# EAGLE design PCB-BI8-2x4RGB (EAGLE 7.7.0)

## Sheet 1 of 2
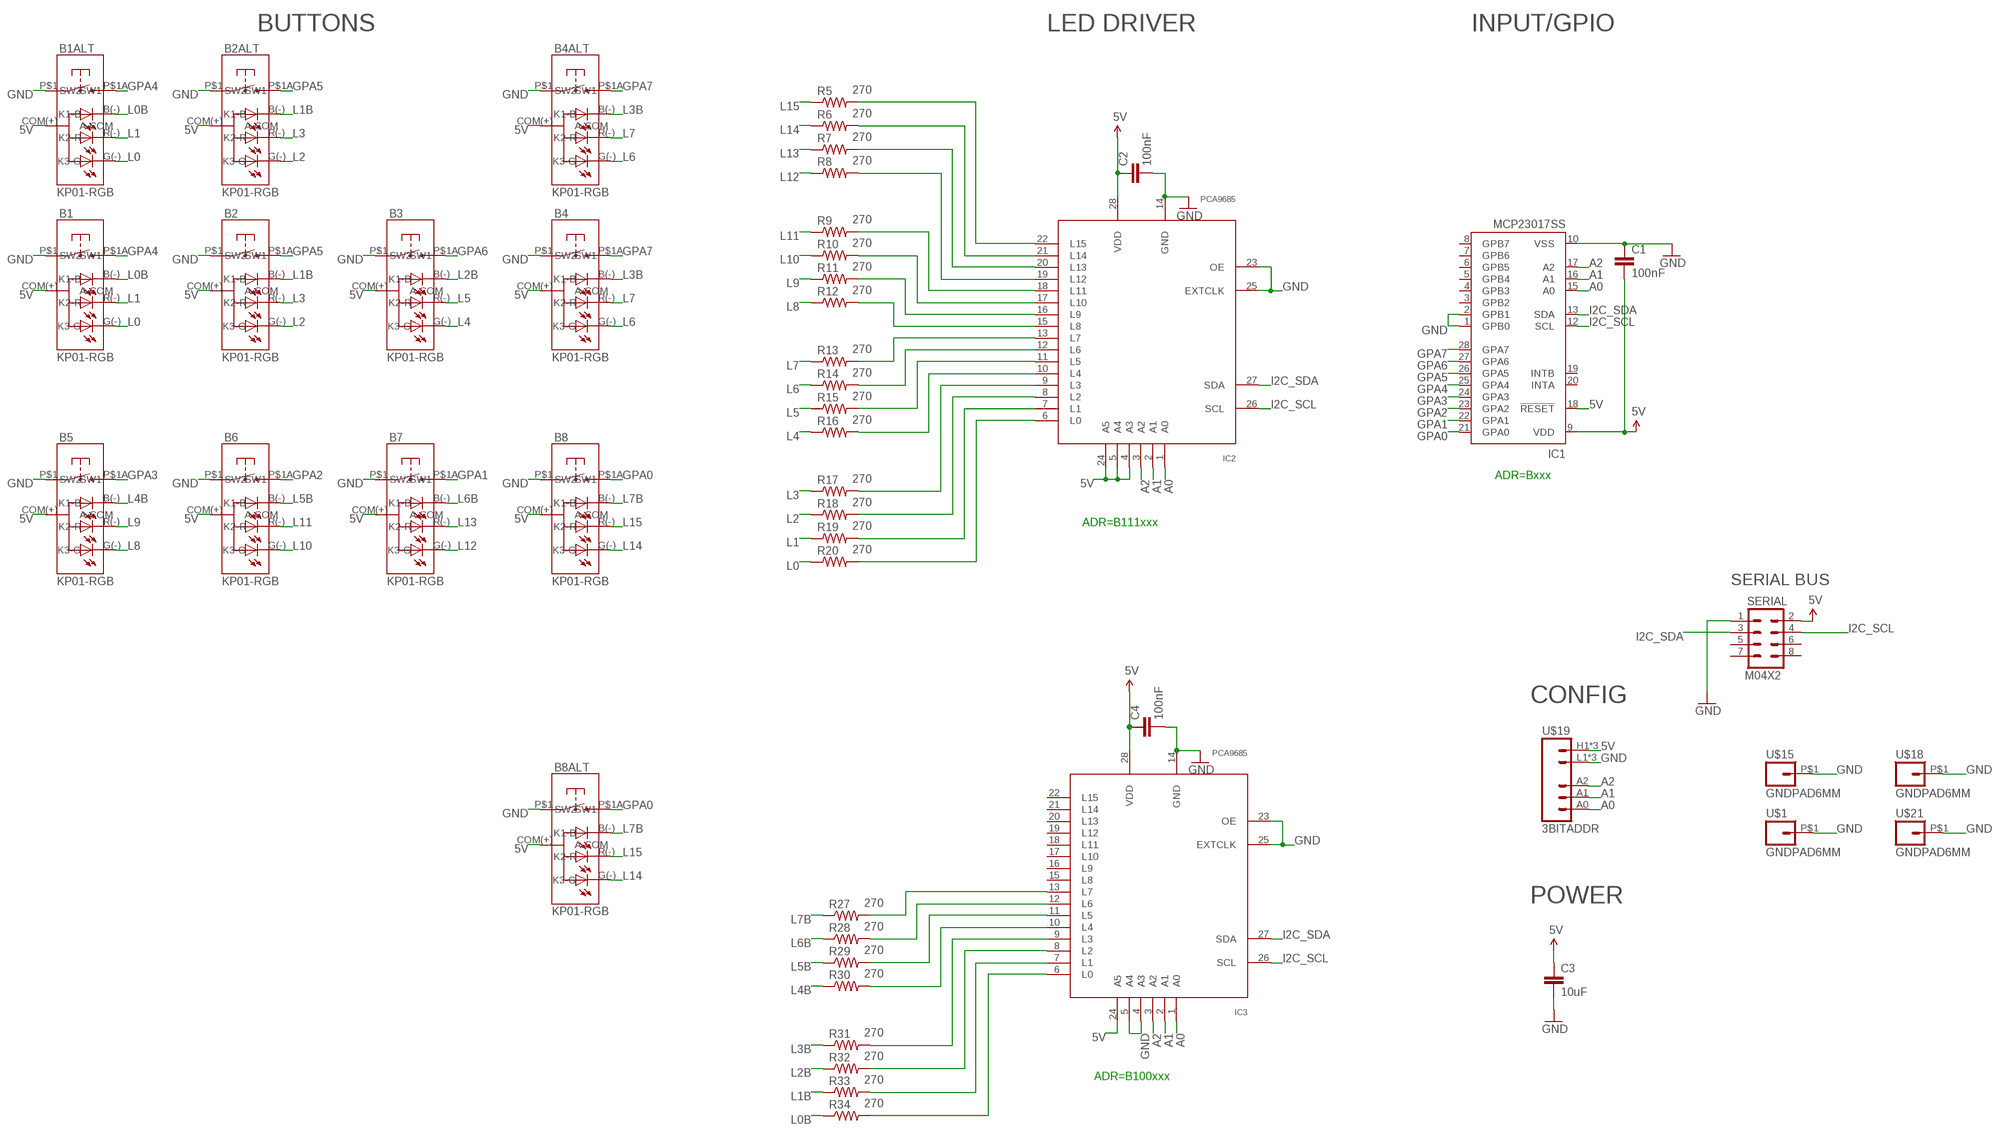
[diagram p0: schematic, sheet 1]

### Parts
B1  KP01-RGB  NKK-KP01  [NKK-KP01]
B1ALT  KP01-RGB  NKK-KP01  [NKK-KP01]
B2  KP01-RGB  NKK-KP01  [NKK-KP01]
B2ALT  KP01-RGB  NKK-KP01  [NKK-KP01]
B3  KP01-RGB  NKK-KP01  [NKK-KP01]
B4  KP01-RGB  NKK-KP01  [NKK-KP01]
B4ALT  KP01-RGB  NKK-KP01  [NKK-KP01]
B5  KP01-RGB  NKK-KP01  [NKK-KP01]
B6  KP01-RGB  NKK-KP01  [NKK-KP01]
B7  KP01-RGB  NKK-KP01  [NKK-KP01]
B8  KP01-RGB  NKK-KP01  [NKK-KP01]
B8ALT  KP01-RGB  NKK-KP01  [NKK-KP01]
C1  100nF  CAP0603-CAP  [0603-CAP]
C2  100nF  CAP0603-CAP  [0603-CAP]
C3  10uF  CAP0805  [0805]
C4  100nF  CAP0603-CAP  [0603-CAP]
IC1  MCP23017SS  [SSOP28]
IC2  PCA9685  [TSSOP28]
IC3  PCA9685  [TSSOP28]
R5  270  RESISTOR0603-RES  [0603-RES]
R6  270  RESISTOR0603-RES  [0603-RES]
R7  270  RESISTOR0603-RES  [0603-RES]
R8  270  RESISTOR0603-RES  [0603-RES]
R9  270  RESISTOR0603-RES  [0603-RES]
R10  270  RESISTOR0603-RES  [0603-RES]
R11  270  RESISTOR0603-RES  [0603-RES]
R12  270  RESISTOR0603-RES  [0603-RES]
R13  270  RESISTOR0603-RES  [0603-RES]
R14  270  RESISTOR0603-RES  [0603-RES]
R15  270  RESISTOR0603-RES  [0603-RES]
R16  270  RESISTOR0603-RES  [0603-RES]
R17  270  RESISTOR0603-RES  [0603-RES]
R18  270  RESISTOR0603-RES  [0603-RES]
R19  270  RESISTOR0603-RES  [0603-RES]
R20  270  RESISTOR0603-RES  [0603-RES]
R27  270  RESISTOR0603-RES  [0603-RES]
R28  270  RESISTOR0603-RES  [0603-RES]
R29  270  RESISTOR0603-RES  [0603-RES]
R30  270  RESISTOR0603-RES  [0603-RES]
R31  270  RESISTOR0603-RES  [0603-RES]
R32  270  RESISTOR0603-RES  [0603-RES]
R33  270  RESISTOR0603-RES  [0603-RES]
R34  270  RESISTOR0603-RES  [0603-RES]
SERIAL  M04X2  [2X4]
U$1  GNDPAD6MM  [3.2MMPAD6MM]
U$15  GNDPAD6MM  [3.2MMPAD6MM]
U$18  GNDPAD6MM  [3.2MMPAD6MM]
U$19  3BITADDR  [3BITADDR]
U$21  GNDPAD6MM  [3.2MMPAD6MM]

### Nets
5V [Power]: B1.COM(+)(A-COM) B1ALT.COM(+)(A-COM) B2.COM(+)(A-COM) B2ALT.COM(+)(A-COM) B3.COM(+)(A-COM) B4.COM(+)(A-COM) B4ALT.COM(+)(A-COM) B5.COM(+)(A-COM) B6.COM(+)(A-COM) B7.COM(+)(A-COM) B8.COM(+)(A-COM) B8ALT.COM(+)(A-COM) C1.2 C2.1 C3.1 C4.1 IC1.9(VDD) IC1.18(!RESET) IC2.4(A3) IC2.5(A4) IC2.24(A5) IC2.28(VDD) IC3.24(A5) IC3.28(VDD) SERIAL.2 U$19.H1(VCC) U$19.H2(VCC) U$19.H3(VCC)
A0: IC1.15(A0) IC2.1(A0) IC3.1(A0) U$19.A0
A1: IC1.16(A1) IC2.2(A1) IC3.2(A1) U$19.A1
A2: IC1.17(A2) IC2.3(A2) IC3.3(A2) U$19.A2
GND [Power]: B1.P$1(SW1) B1ALT.P$1(SW1) B2.P$1(SW1) B2ALT.P$1(SW1) B3.P$1(SW1) B4.P$1(SW1) B4ALT.P$1(SW1) B5.P$1(SW1) B6.P$1(SW1) B7.P$1(SW1) B8.P$1(SW1) B8ALT.P$1(SW1) C1.1 C2.2 C3.2 C4.2 IC1.1(GPB0) IC1.2(GPB1) IC1.10(VSS) IC2.14(GND) IC2.23(OE) IC2.25(EXTCLK) IC3.4(A3) IC3.5(A4) IC3.14(GND) IC3.23(OE) IC3.25(EXTCLK) SERIAL.1 U$1.P$1 U$15.P$1 U$18.P$1 U$19.L1(GND) U$19.L2(GND) U$19.L3(GND) U$21.P$1
GPA0: B8.P$1A(SW2) B8ALT.P$1A(SW2) IC1.21(GPA0)
GPA1: B7.P$1A(SW2) IC1.22(GPA1)
GPA2: B6.P$1A(SW2) IC1.23(GPA2)
GPA3: B5.P$1A(SW2) IC1.24(GPA3)
GPA4: B1.P$1A(SW2) B1ALT.P$1A(SW2) IC1.25(GPA4)
GPA5: B2.P$1A(SW2) B2ALT.P$1A(SW2) IC1.26(GPA5)
GPA6: B3.P$1A(SW2) IC1.27(GPA6)
GPA7: B4.P$1A(SW2) B4ALT.P$1A(SW2) IC1.28(GPA7)
I2C_SCL: IC1.12(SCL) IC2.26(SCL) IC3.26(SCL) SERIAL.4
I2C_SDA: IC1.13(SDA) IC2.27(SDA) IC3.27(SDA) SERIAL.3
L0: B1.G(-)(K3-G) B1ALT.G(-)(K3-G) R20.1
L0B: B1.B(-)(K1-B) B1ALT.B(-)(K1-B) R34.1
L1: B1.R(-)(K2-R) B1ALT.R(-)(K2-R) R19.1
L1B: B2.B(-)(K1-B) B2ALT.B(-)(K1-B) R33.1
L2: B2.G(-)(K3-G) B2ALT.G(-)(K3-G) R18.1
L2B: B3.B(-)(K1-B) R32.1
L3: B2.R(-)(K2-R) B2ALT.R(-)(K2-R) R17.1
L3B: B4.B(-)(K1-B) B4ALT.B(-)(K1-B) R31.1
L4: B3.G(-)(K3-G) R16.1
L4B: B5.B(-)(K1-B) R30.1
L5: B3.R(-)(K2-R) R15.1
L5B: B6.B(-)(K1-B) R29.1
L6: B4.G(-)(K3-G) B4ALT.G(-)(K3-G) R14.1
L6B: B7.B(-)(K1-B) R28.1
L7: B4.R(-)(K2-R) B4ALT.R(-)(K2-R) R13.1
L7B: B8.B(-)(K1-B) B8ALT.B(-)(K1-B) R27.1
L8: B5.G(-)(K3-G) R12.1
L9: B5.R(-)(K2-R) R11.1
L10: B6.G(-)(K3-G) R10.1
L11: B6.R(-)(K2-R) R9.1
L12: B7.G(-)(K3-G) R8.1
L13: B7.R(-)(K2-R) R7.1
L14: B8.G(-)(K3-G) B8ALT.G(-)(K3-G) R6.1
L15: B8.R(-)(K2-R) B8ALT.R(-)(K2-R) R5.1
N$2: IC3.13(L7) R27.2
N$3: IC3.12(L6) R28.2
N$4: IC2.13(L7) R13.2
N$5: IC2.12(L6) R14.2
N$6: IC3.11(L5) R29.2
N$7: IC2.11(L5) R15.2
N$9: IC2.10(L4) R16.2
N$10: IC2.9(L3) R17.2
N$11: IC2.8(L2) R18.2
N$12: IC2.7(L1) R19.2
N$13: IC3.10(L4) R30.2
N$14: IC3.9(L3) R31.2
N$15: IC3.8(L2) R32.2
N$16: IC3.7(L1) R33.2
N$17: IC3.6(L0) R34.2
N$19: IC2.6(L0) R20.2
N$20: IC2.15(L8) R12.2
N$21: IC2.16(L9) R11.2
N$22: IC2.17(L10) R10.2
N$23: IC2.18(L11) R9.2
N$24: IC2.19(L12) R8.2
N$25: IC2.20(L13) R7.2
N$26: IC2.21(L14) R6.2
N$27: IC2.22(L15) R5.2
Unconnected: IC1.3(GPB2) IC1.4(GPB3) IC1.5(GPB4) IC1.6(GPB5) IC1.7(GPB6) IC1.8(GPB7) IC1.19(INTB) IC1.20(INTA) IC3.15(L8) IC3.16(L9) IC3.17(L10) IC3.18(L11) IC3.19(L12) IC3.20(L13) IC3.21(L14) IC3.22(L15) SERIAL.5 SERIAL.6 SERIAL.7 SERIAL.8

### Notes on the sheet
- BUTTONS | LED DRIVER | INPUT/GPIO
- ADR=Bxxx
- ADR=B111xxx
- SERIAL BUS
- CONFIG
- POWER
- ADR=B100xxx

## Sheet 2 of 2

## Library data of the parts
B1 B1ALT B2 B2ALT B3 B4 B4ALT B5-B8 B8ALT = SKAARHOJ:NKK-KP01: NKK-KP01-15AC 100mA12VDC
C1-C4 = SparkFun:CAP: Capacitor Standard 0603 ceramic capacitor, and 0.1" leaded capacitor.
IC1 = microchip:MCP23017: http://ww1.microchip.com/downloads/en/DeviceDoc/21952a.pdf Source: http://ww1.microchip.com/downloads/en/DeviceDoc/21952a.pdf; MF: MICROCHIP; MPN: MCP23017-E/SS; OC_FARNELL: 1467674; OC_NEWARK: 31K2960
IC2 IC3 = wsmith:PCA9685
R5-R20 R27-R34 = SparkFun:RESISTOR: Resistor Basic schematic elements and footprints for 0603, 1206, and PTH resistors.
SERIAL = SparkFun:M04X2
U$1 U$15 U$18 U$21 = SKAARHOJ:GNDPAD
U$19 = SKAARHOJ:3BITADDR

## Net classes
0 default: width 0.152 mm, drill 0.254 mm, clearance 0.152 mm
1 Power: width 0.406 mm, drill 0.61 mm, clearance 0.203 mm

## Board
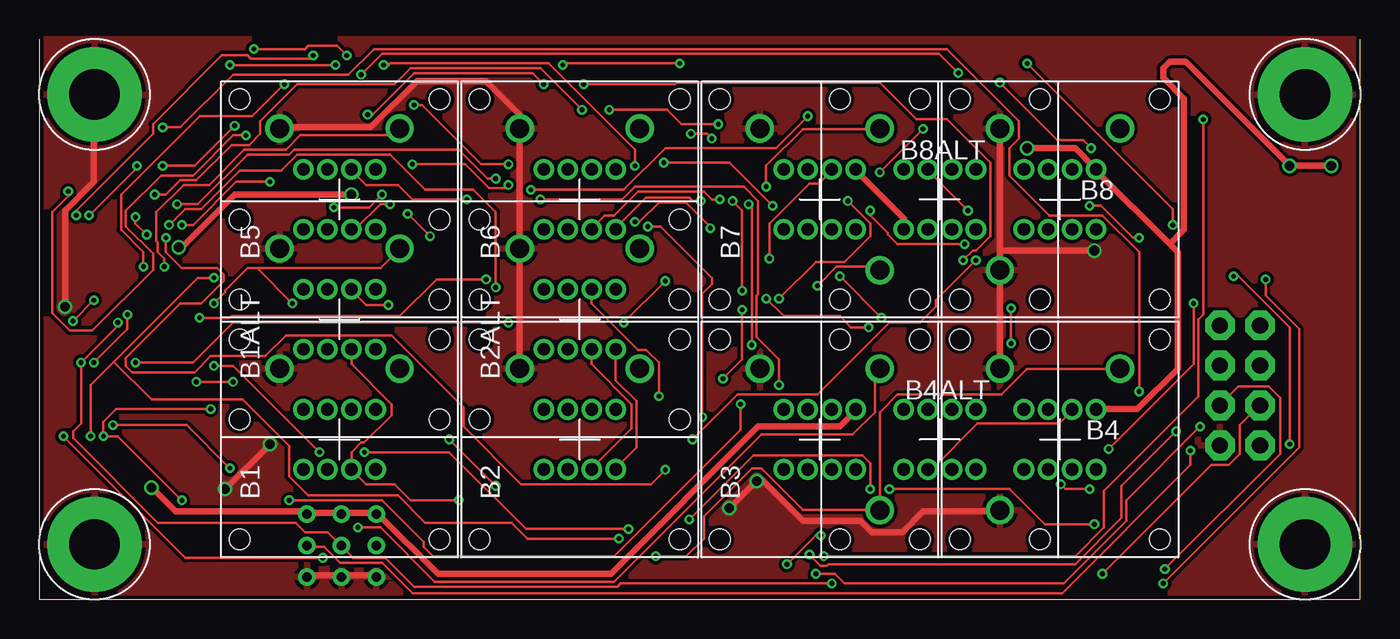
[diagram p1: board, top side]
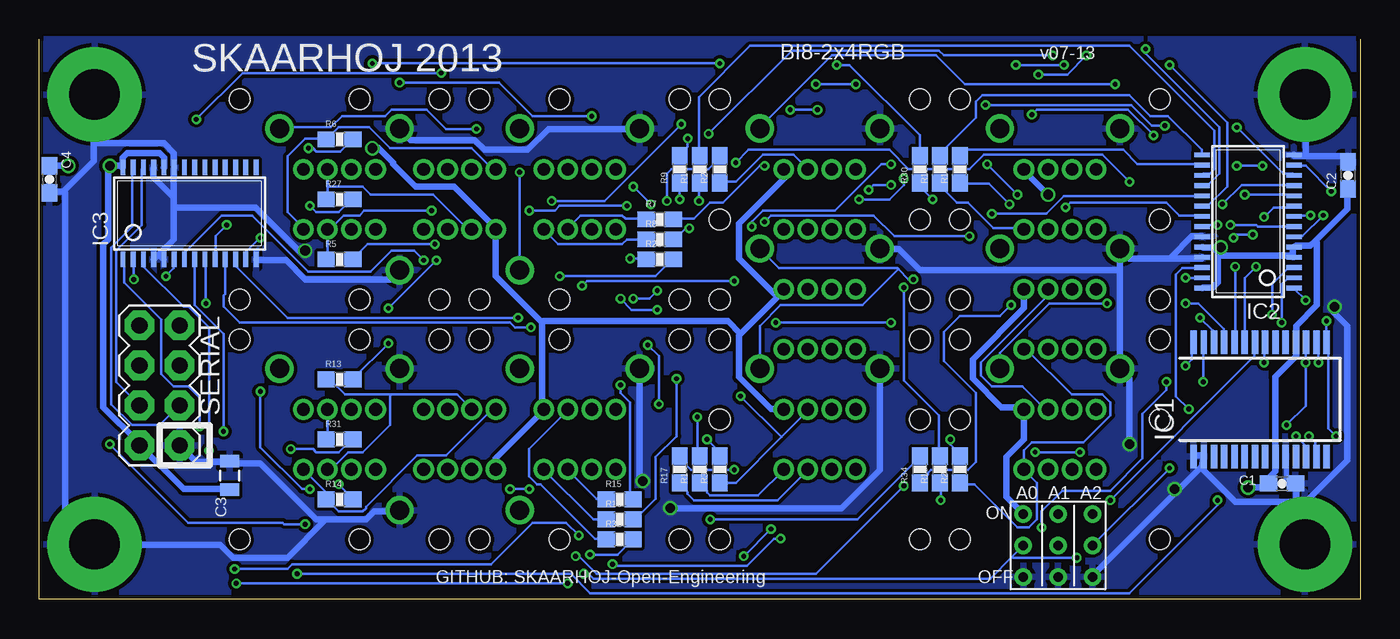
[diagram p2: board, bottom side, seen from below]

Size 83.82 x 35.56 mm. Coordinates in mm from the lower left corner, seen from the top.
Outline: 83.82,35.56 83.82,0 0,0 0,35.56
Copper layers (1*16): Top 0.035mm / dielectric 1.5mm / Bottom 0.035mm
Design rules "Fusion_eagle_rule_v1.1": minimum track width 6mil, minimum drill 12mil, track to track 6mil, track to pad 6mil, pad to pad 6mil, via to via 6mil, smd to smd 0mil, copper to edge 10mil, drill to drill 10mil, minimum pad ring 10mil, minimum via ring 6mil, stop-mask expansion 2mil, vias tented up to drill 100mil, thermal gap 10mil

### Footprints (pad centres in the part's own frame; a part is rotated, then mirrored left to right if it is on the bottom)
NKK-KP01 = drill 0.8: B(-) 1.905,-0.762; COM(+) 1.905,-2.286; G(-) -1.905,-2.286; P$3 1.905,0.762; P$4 1.905,2.286; P$7 -1.905,0.762; P$8 -1.905,2.286; R(-) -1.905,-0.762 | drill 1.2: P$1 4.496,3.81; P$1A 4.496,-3.81 | hole 1.3: -6.35,6.35; 6.35,6.35; 6.35,-6.35; -6.35,-6.35
0603-CAP = smd 1.1 x 1: 1 -0.85,0; 2 0.85,0
0805 = smd 0.8 x 1.2: 1 -0.9,0; 2 0.9,0
SSOP28 = smd 0.4 x 1.5: 1 -4.225,-3.625; 2 -3.575,-3.625; 3 -2.925,-3.625; 4 -2.275,-3.625; 5 -1.625,-3.625; 6 -0.975,-3.625; 7 -0.325,-3.625; 8 0.325,-3.625; 9 0.975,-3.625; 10 1.625,-3.625; 11 2.275,-3.625; 12 2.925,-3.625; 13 3.575,-3.625; 14 4.225,-3.625; 15 4.225,3.625; 16 3.575,3.625; 17 2.925,3.625; 18 2.275,3.625; 19 1.625,3.625; 20 0.975,3.625; 21 0.325,3.625; 22 -0.325,3.625; 23 -0.975,3.625; 24 -1.625,3.625; 25 -2.275,3.625; 26 -2.925,3.625; 27 -3.575,3.625; 28 -4.225,3.625
TSSOP28 = smd 0.305 x 0.991: 1 -4.225,-2.918; 2 -3.575,-2.918; 3 -2.925,-2.918; 4 -2.275,-2.918; 5 -1.625,-2.918; 6 -0.975,-2.918; 7 -0.325,-2.918; 8 0.325,-2.918; 9 0.975,-2.918; 10 1.625,-2.918; 11 2.275,-2.918; 12 2.925,-2.918; 13 3.575,-2.918; 14 4.225,-2.918; 15 4.225,2.918; 16 3.575,2.918; 17 2.925,2.918; 18 2.275,2.918; 19 1.625,2.918; 20 0.975,2.918; 21 0.325,2.918; 22 -0.325,2.918; 23 -0.975,2.918; 24 -1.625,2.918; 25 -2.275,2.918; 26 -2.925,2.918; 27 -3.575,2.918; 28 -4.225,2.918
0603-RES = smd 1.1 x 1: 1 -0.85,0; 2 0.85,0
2X4 = drill 1.016 pad 1.88 octagon: 1 -3.81,-1.27; 2 -3.81,1.27; 3 -1.27,-1.27; 4 -1.27,1.27; 5 1.27,-1.27; 6 1.27,1.27; 7 3.81,-1.27; 8 3.81,1.27
3.2MMPAD6MM = drill 3.2 pad 6: P$1 0,0
3BITADDR = drill 0.6: A0 -2.2,0; A1 0,0; A2 2.2,0; H1 -2.2,2; H2 0,2; H3 2.2,2; L1 -2.2,-2; L2 0,-2; L3 2.2,-2

### Placement (x,y rotation side)
B1  19.05,10.16 90 top
B1ALT  19.05,17.78 90 top
B2  34.29,10.16 90 top
B2ALT  34.29,17.78 90 top
B3  49.53,10.16 90 top
B4  64.77,10.16 90 top
B4ALT  57.15,10.16 270 top
B5  19.05,25.4 90 top
B6  34.29,25.4 90 top
B7  49.53,25.4 90 top
B8  64.77,25.4 90 top
B8ALT  57.15,25.4 270 top
C1  4.95,7.37 180 bottom
C2  0.76,26.92 90 bottom
C3  71.75,7.87 90 bottom
C4  83.19,26.67 270 bottom
IC1  6.35,12.7 0 bottom
IC2  7.11,24 90 bottom
IC3  74.3,24.51 0 bottom
R5  64.77,21.59 0 bottom
R6  64.77,29.21 0 bottom
R7  44.45,24.13 0 bottom
R8  44.45,22.86 0 bottom
R9  43.18,27.3 90 bottom
R10  41.91,27.3 90 bottom
R11  25.4,27.3 90 bottom
R12  26.67,27.3 90 bottom
R13  64.77,13.97 0 bottom
R14  64.77,6.35 0 bottom
R15  46.99,6.35 0 bottom
R16  46.99,5.08 0 bottom
R17  43.18,8.26 90 bottom
R18  41.91,8.26 90 bottom
R19  26.67,8.26 90 bottom
R20  25.4,8.26 90 bottom
R27  64.77,25.4 0 bottom
R28  44.45,21.59 0 bottom
R29  40.64,27.3 90 bottom
R30  27.94,27.3 90 bottom
R31  64.77,10.16 0 bottom
R32  46.99,3.81 0 bottom
R33  40.64,8.26 90 bottom
R34  27.94,8.26 90 bottom
SERIAL  76.2,13.59 90 bottom
U$1  3.5,3.5 0 top
U$15  3.5,32.06 0 top
U$18  80.32,3.5 0 top
U$19  19.18,3.43 0 bottom
U$21  80.32,32.06 0 top

### Tracks (layer width: path | path; a pad name or v marks a point on that pad's centre or on a via)
5V  (via drill 0.61)
  Top 0.406: v19.81,25.7 12.39,25.7 9.04,22.35 v8.84,22.35 | v7.11,7.11 8.64,5.59 16.87,5.59 U$19.H3 17.07,5.49 19.1,5.49 U$19.H2 19.3,5.49 21.34,5.49 U$19.H1 21.54,5.38 25.3,1.63 36.27,1.63 45.62,10.97 50.8,10.97 51.82,11.99 B3.COM(+) | B8ALT.COM(+) 54.86,24.18 51.82,27.23 B7.COM(+) | 71.73,22.55 67.06,27.23 B8.COM(+) 66.95,27.43 65.73,28.65 v62.69,28.65 | 71.73,22.55 72.24,22.05 72.24,14.63 69.7,12.09 67.06,12.09 B4.COM(+) | v81.99,27.53 v79.35,27.53 72.75,34.14 71.73,34.14 71.32,33.73 71.32,33.12 72.64,31.8 72.64,23.47 71.73,22.55
  Bottom 0.406: U$19.H1 21.44,5.49 22.45,6.5 22.45,9.04 21.34,10.16 B1.COM(+) 21.44,12.19 22.76,12.19 24.59,14.02 24.59,15.24 21.34,18.49 B1ALT.COM(+) | 9.04,22.05 9.04,21.84 | 9.04,21.84 9.04,20.12 9.35,19.81 9.96,19.81 IC2.28 | 9.04,22.05 9.35,22.35 9.96,22.35 IC2.24 | 2.85,22.76 3.15,22.45 4.06,22.45 IC2.5 4.27,22.35 4.27,21.74 IC2.4 4.37,21.84 9.04,21.84 | 2.85,22.76 0.81,24.79 0.81,26.01 C2.1 | 2.85,22.76 2.74,22.66 2.74,18.69 4.06,17.37 4.06,16.36 IC1.18 4.06,16.15 4.06,15.44 5.38,14.12 5.38,9.25 IC1.9 5.38,9.04 5.38,8.13 5.79,7.72 5.79,7.42 C1.2 5.99,7.32 6.2,7.11 v7.11,7.11 | v19.81,25.7 21.34,27.23 B5.COM(+) | v8.84,22.35 9.04,22.15 9.04,22.05 | 39.32,16.87 36.58,19.61 B2ALT.COM(+) 37.08,19.3 39.42,21.64 39.42,23.88 36.58,26.72 B6.COM(+) | 39.32,16.87 39.42,16.76 39.42,14.12 37.39,12.09 36.58,12.09 B2.COM(+) | B4ALT.COM(+) 54.86,8.94 51.82,11.99 B3.COM(+) 51.92,12.19 51.92,17.58 | 51.92,17.58 54.86,20.52 B8ALT.COM(+) 54.97,23.67 57.51,26.21 59.94,26.21 61.37,27.64 61.37,27.74 62.28,28.65 v62.69,28.65 | 39.32,16.87 40.13,17.68 51.82,17.68 51.92,17.58 | IC3.24 75.89,27.43 75.89,28.04 76.2,28.35 78.23,28.35 78.54,28.04 78.54,27.43 IC3.28 78.64,27.53 v79.35,27.53 79.45,27.43 79.45,22.86 79.76,22.55 79.76,12.19 77.52,9.96 SERIAL.2 77.42,9.75 74.68,7.01 71.83,7.01 C3.1 | v81.99,27.53 83.11,27.53 C4.1
A0  (via drill 0.3)
  Top 0.152: v2.13,17.68 v3.45,19 | v73.66,10.97 68.99,6.3 68.99,4.98 65.02,1.02 51.1,1.02 50.49,1.63 v49.28,1.63 | v1.52,10.36 9.25,2.64 v17.98,2.64
  Bottom 0.152: v3.45,19 4.17,19.71 IC2.1 | v2.13,17.68 2.13,16.36 IC1.15 2.03,16.26 2.03,10.87 v1.52,10.36 | v73.66,10.97 73.66,12.8 74.37,13.51 75.29,13.51 76.1,14.33 76.1,17.78 78.44,20.12 78.44,21.54 IC3.1 | v49.28,1.63 48.97,1.63 48.67,1.32 23.47,1.32 22.1,2.69 | 22.1,2.69 21.44,3.35 U$19.A0 | v17.98,2.64 22.05,2.64 22.1,2.69
A1  (via drill 0.3)
  Top 0.152: v4.98,17.58 4.98,17.37 v2.64,15.04 2.64,11.18 2.13,10.67 2.13,10.26 7.52,4.88 16.26,4.88 16.87,4.27 18.29,4.27 19.1,3.45 U$19.A1 19.2,3.35 19.91,2.64 21.95,2.64 23.77,0.81 36.68,0.81 36.88,1.02 v50.29,1.02 | v77.83,20.32 77.83,19.3 79.96,17.17 79.96,9.65 v71.32,1.02
  Bottom 0.152: v4.98,17.58 4.98,20.02 4.57,20.42 4.27,20.42 IC2.2 | v2.64,15.04 2.64,16.15 2.74,16.26 IC1.16 | v77.83,20.32 77.83,21.54 IC3.2 | v50.29,1.02 v71.32,1.02
A2  (via drill 0.3)
  Top 0.152: v5.59,18.09 5.59,17.17 v3.45,15.04 | v73.05,9.45 73.05,8.53 64.92,0.41 23.67,0.41 21.74,2.34 19.1,2.34 18.09,3.35 17.07,3.35 U$19.A2 | v4.67,11.07 9.35,11.07 v12.09,8.33
  Bottom 0.152: v5.59,18.09 5.59,20.02 4.57,21.03 4.27,21.03 IC2.3 | IC1.17 3.45,16.26 v3.45,15.04 3.45,12.29 v4.67,11.07 | v73.05,9.45 73.05,17.27 74.37,18.59 74.68,18.59 77.22,21.13 77.22,21.54 IC3.3 | v12.09,8.33 16.97,3.45 U$19.A2
GND  (via drill 0.61)
  Top 0.406: U$19.L3 17.07,1.52 19.1,1.52 U$19.L2 19.3,1.52 21.34,1.52 U$19.L1 | v1.63,18.59 1.63,24.69 3.45,26.52 3.45,32 U$15.P$1 | B4.P$1 B8ALT.P$1 60.96,22.15 | B8.P$1 60.96,22.15 | B2.P$1 B2ALT.P$1 B6.P$1 30.48,30.79 28.35,32.92 23.98,32.92 21.03,29.97 15.24,29.97 B5.P$1 | B4ALT.P$1 60.96,5.59 56.08,5.59 54.76,4.27 52.83,4.27 52.12,4.98 48.46,4.98 45.92,7.52 v45.52,7.52 v43.79,5.79 | v66.95,22.15 60.96,22.15 | v14.63,9.86 v11.79,7.01
  Bottom 0.305: IC1.10 4.7,9.07 4.7,7.75 4.1,7.75 C1.1
  Bottom 0.406: 3.45,28.14 1.12,28.14 0.81,27.84 C2.2 | 3.45,28.14 4.17,28.14 IC2.14 | 3.45,28.14 3.45,32 U$15.P$1 | IC1.2 9.96,9.14 10.57,9.14 IC1.1 | U$1.P$1 4.06,4.06 4.06,7.32 C1.1 | IC1.2 9.96,8.94 9.96,8.23 7.92,6.2 4.17,6.2 U$1.P$1 | 11.68,6.81 10.06,8.43 IC1.2 | 11.68,6.81 16.97,1.52 U$19.L3 | v1.63,18.59 1.63,18.19 0.81,17.37 0.81,8.84 3.86,5.79 U$1.P$1 | IC3.14 70,21.54 68.17,21.54 66.95,20.32 61.47,20.32 60.96,20.83 B8ALT.P$1 | B7.P$1 45.72,29.87 51.51,29.87 52.83,28.55 55.58,28.55 56.19,29.16 60.25,29.16 60.96,29.87 B8.P$1 | 11.99,21.64 14.63,21.64 15.24,22.25 B1ALT.P$1 15.24,20.93 | 11.99,21.64 10.06,21.64 IC2.25 | IC2.23 10.06,23.06 10.67,23.06 11.99,21.74 11.99,21.64 | 15.24,20.93 B1.P$1 15.14,14.53 14.63,14.02 v14.63,9.86 | 15.24,20.93 27.94,20.93 29.26,22.25 30.48,22.25 B2ALT.P$1 | 75.29,24.89 75.29,22.86 76.25,21.89 | 75.29,24.89 75.29,25.6 | 75.29,25.6 75.29,27.33 IC3.23 75.29,27.64 75.29,28.35 75.89,28.96 80.37,28.96 | 76.25,21.89 76.5,21.64 IC3.4 | 76.25,21.89 76,21.64 IC3.5 | IC3.25 76.61,27.33 76.61,26.82 75.39,25.6 75.29,25.6 | 82.3,25.91 83.11,25.91 C4.2 | 82.3,25.91 80.37,27.84 80.37,28.96 | 80.37,28.96 80.37,32 U$21.P$1 | SERIAL.1 74.88,9.75 73.86,8.74 71.83,8.74 C3.2 71.63,8.64 69.8,8.64 66.24,5.08 65.73,5.08 | 65.73,5.08 63.09,5.08 62.59,5.59 60.96,5.59 B4ALT.P$1 | B3.P$1 45.72,7.72 v45.52,7.52 | 65.73,5.08 65.73,4.98 68.07,2.64 71.53,2.64 72.34,3.45 80.26,3.45 U$18.P$1 80.37,3.66 82.19,5.49 82.19,25.81 82.3,25.91 | B2.P$1 30.48,8.23 32.92,5.79 v43.79,5.79 | v66.95,22.15 67.36,22.15 70.1,24.89 75.29,24.89 | v11.79,7.01 11.79,6.91 11.68,6.81
  pour Top: 0,0 83.82,0 83.82,35.56 0,35.56
  pour Bottom: 0,0 83.82,0 83.82,35.56 0,35.56
GPA0  (via drill 0.3)
  Top 0.152: v6.1,15.04 9.75,15.04 12.29,17.58 v29.77,17.58 | v39.73,20.22 v37.08,17.58 | v49.38,19.91 50.6,21.13 53.14,21.13 53.34,20.93 B8ALT.P$1A | v53.34,27.13 v56.08,29.87
  Bottom 0.152: v6.1,15.04 6.1,16.26 IC1.21 | v37.08,17.58 v29.77,17.58 | v39.73,20.22 49.07,20.22 v49.38,19.91 | v56.08,29.87 58.01,29.87 59.23,31.09 61.47,31.09 61.87,30.68 64.62,30.68 65.33,29.97 68.58,29.97 B8.P$1A | B8ALT.P$1A v53.34,27.13
GPA1  (via drill 0.3)
  Top 0.152: v15.85,6.3 21.74,6.3 24.38,3.66 24.38,3.35 24.99,2.74 36.47,2.74 44.5,10.77 v44.5,12.39 | v45.21,16.15 45.21,24.89 v45.01,25.09 | v46.13,26.21 46.13,27.53 48.46,29.87 53.34,29.87 B7.P$1A
  Bottom 0.152: v15.85,6.3 6.71,15.44 6.71,16.26 IC1.22 | v44.5,12.39 44.5,15.44 v45.21,16.15 | v46.13,26.21 v45.01,25.09
GPA2  (via drill 0.3)
  Top 0.152: v6.6,21.13 6.6,22.05 5.18,23.47 5.18,25.7 10.16,30.68 13.51,30.68 v15.54,32.72
  Bottom 0.152: v6.6,21.13 7.32,20.42 7.32,16.36 IC1.23 | v15.54,32.72 25.09,32.72 26.92,34.54 33.53,34.54 38.1,29.97 B6.P$1A
GPA3  (via drill 0.3)
  Top 0.152: v7.92,21.13 7.92,21.64 7.52,22.05 7.52,22.66 7.42,22.76 7.42,24.59 9.14,26.31 10.77,26.31 13.01,28.55 15.65,28.55 16.56,29.46 22.45,29.46 22.86,29.87 B5.P$1A
  Bottom 0.152: v7.92,21.13 7.92,16.36 IC1.24
GPA4  (via drill 0.3)
  Top 0.152: v11.07,18.8 11.79,19.51 11.79,19.61 13.21,21.03 13.82,21.03 | 13.82,21.03 21.64,21.03 22.86,22.25 B1ALT.P$1A | 13.82,21.03 v16.05,18.8
  Bottom 0.152: v11.07,18.8 10.26,18.8 8.64,17.17 8.64,16.36 IC1.25 | B1.P$1A 22.86,15.65 19.71,18.8 v16.05,18.8
GPA5  (via drill 0.3)
  Top 0.152: v10.16,17.88 12.09,17.88 12.19,17.98 22.86,17.98 25.2,20.32 v28.35,20.32
  Bottom 0.152: v10.16,17.88 9.35,17.07 9.35,16.36 IC1.26 | v28.35,20.32 28.65,20.32 29.31,20.98 | 29.31,20.98 29.36,21.03 36.88,21.03 38.1,22.25 B2ALT.P$1A | B2.P$1A 38.1,17.37 36.78,18.69 31.6,18.69 29.31,20.98
GPA6  (via drill 0.3)
  Top 0.152: v12.29,13.82 v9.96,13.82 | v20.22,4.57 21.64,4.57 25.09,1.12 36.47,1.12 45.82,10.46 51.61,10.46 53.03,11.89 53.03,14.33 53.34,14.63 B3.P$1A
  Bottom 0.152: v9.96,13.82 9.96,16.26 IC1.27 | v12.29,13.82 12.29,13.31 13.82,11.79 13.82,8.94 15.85,6.91 18.9,6.91 20.22,5.59 v20.22,4.57
GPA7  (via drill 0.3)
  Top 0.152: v11.07,14.83 12.29,14.83 v17.78,9.35 | v20.62,9.35 26.01,9.35 30.89,4.47 v37.39,4.47 | v39.12,2.74 41.05,2.74 42.16,3.86 42.16,5.28 45.21,8.33 45.82,8.33 48.46,5.69 53.34,5.69 | 53.34,5.69 53.34,11.89 54.46,13.01 61.06,13.01 62.69,14.63 68.58,14.63 B4.P$1A | 53.34,5.69 B4ALT.P$1A
  Bottom 0.152: v11.07,14.83 10.67,15.24 10.67,16.26 IC1.28 | v20.62,9.35 v17.78,9.35 | v39.12,2.74 v37.39,4.47
I2C_SCL  (via drill 0.3)
  Top 0.152: v10.87,12.09 4.88,12.09 4.06,11.28 v4.06,10.36 4.98,10.36 v9.04,6.3 | v67.46,1.63 74.37,8.53 75.49,8.53 76.2,9.25 76.2,11.07 77.42,12.29 SERIAL.4
  Bottom 0.152: v10.87,12.09 11.68,12.9 11.68,20.62 11.28,21.03 10.06,21.03 IC2.26 | v4.06,10.36 3.45,9.75 3.45,9.14 IC1.12 | IC3.26 77.32,27.33 77.32,23.77 78.94,22.15 78.94,13.82 77.52,12.39 SERIAL.4 | v9.04,6.3 9.04,5.99 14.63,0.41 48.87,0.41 50.09,1.63 v67.46,1.63
I2C_SDA  (via drill 0.3)
  Top 0.152: v11.07,20.42 10.06,20.42 4.72,15.09 | 4.72,15.09 3.25,13.61 v3.25,10.36 | 4.72,15.09 7.11,12.7 12.9,12.7 15.85,9.75 15.85,7.82 17.07,6.6 22.76,6.6 24.49,4.88 29.97,4.88 30.99,3.86 v36.78,3.86 | v47.45,2.23 49.28,4.06 v49.58,4.06 | v71.42,1.93 78.74,9.25 78.74,12.8 78.03,13.51 76.1,13.51 74.98,12.39 SERIAL.3
  Bottom 0.152: v11.07,20.42 10.06,20.42 IC2.27 | v3.25,10.36 2.85,9.96 2.85,9.14 IC1.13 | IC3.27 77.93,27.33 77.93,23.67 79.25,22.35 79.25,12.39 77.93,11.07 76.2,11.07 74.98,12.29 SERIAL.3 | v36.78,3.86 37.19,3.86 38.91,2.13 47.35,2.13 v47.45,2.23 | v49.58,4.06 50.39,4.88 52.53,4.88 55.17,2.23 67.77,2.23 68.07,1.93 v71.42,1.93
L0
  Bottom 0.152: R20.1 25.4,7.32 24.49,7.32 21.74,4.57 21.03,4.57 20.52,5.08 20.52,7.42 21.34,8.23 B1.G(-) 21.34,9.45 20.83,9.96 17.58,9.96 15.85,11.68 15.85,12.5 16.36,13.01 18.29,13.01 21.13,15.85 21.34,15.85 B1ALT.G(-)
L0B  (via drill 0.3)
  Top 0.152: v22.15,18.69 20.73,18.69 19.81,19.61 B1ALT.B(-)
  Bottom 0.152: v22.15,18.69 22.86,17.98 25.4,17.98 26.42,16.97 26.42,15.14 24.38,13.11 24.38,8.74 24.89,8.23 27.23,8.23 27.43,8.03 27.43,7.92 R34.1 | B1ALT.B(-) 19.81,19.3 24.08,15.04 24.08,14.22 23.37,13.51 21.44,13.51 20.02,12.09 19.81,12.09 B1.B(-)
L1  (via drill 0.3)
  Top 0.152: v26.62,6.3 23.57,6.3 22.55,7.32 20.73,7.32 19.81,8.23 B1.R(-) 19.81,9.35 20.42,9.96 20.62,9.96 22.35,11.68 22.35,12.39 19.81,14.94 B1ALT.R(-)
  Bottom 0.152: v26.62,6.3 26.62,7.32 R19.1
L1B  (via drill 0.3)
  Top 0.152: B2ALT.B(-) 35.05,18.8 38,15.85 38.51,15.85 39.32,15.04 v39.32,12.9
  Bottom 0.152: 36.73,10.31 35.05,11.99 B2.B(-) | 36.73,10.31 39.62,7.42 R33.1 | 36.73,10.31 v39.32,12.9
L2
  Top 0.152: B2ALT.G(-) 36.58,13.92 37.9,12.6 37.9,9.65 36.58,8.33 B2.G(-)
  Bottom 0.152: R18.1 41.86,7.32 41.45,6.91 41.45,6.81 41.25,6.6 38.2,6.6 36.58,8.23 B2.G(-)
L2B
  Bottom 0.152: R32.1 47.85,3.86 48.56,3.86 52.02,7.32 52.22,7.32 52.73,7.82 52.73,9.55 50.29,11.99 B3.B(-)
L3
  Top 0.152: B2ALT.R(-) 35.05,14.94 37.59,12.39 37.59,10.87 35.05,8.33 B2.R(-)
  Bottom 0.152: R17.1 43.18,7.32 42.67,6.81 42.67,6.71 42.27,6.3 36.98,6.3 35.05,8.23 B2.R(-)
L3B
  Top 0.152: B4ALT.B(-) 56.39,8.33 56.69,8.33 59.54,11.18 64.72,11.18 65.53,11.99 B4.B(-)
  Bottom 0.152: B4.B(-) 65.53,10.16 R31.1
L4
  Bottom 0.152: R16.1 48.67,5.08 51.82,8.23 B3.G(-)
L4B  (via drill 0.3)
  Top 0.152: v27.13,25.4 23.67,25.4 22.76,26.31 20.73,26.31 19.81,27.23 B5.B(-)
  Bottom 0.152: R30.1 27.94,26.21 v27.13,25.4
L5
  Bottom 0.152: R15.1 47.85,6.4 48.46,6.4 50.29,8.23 B3.R(-)
L5B
  Bottom 0.152: R29.1 40.64,26.52 39.62,26.52 37.9,28.25 35.97,28.25 35.05,27.33 B6.B(-)
L6
  Bottom 0.152: B4.G(-) 67.06,8.23 65.63,6.81 65.63,6.4 R14.1 65.53,6.3 64.82,5.59 63.3,5.59 63.09,5.79 63.09,5.89 59.84,9.14 58.01,9.14 55.17,11.99 54.86,11.99 B4ALT.G(-)
L6B  (via drill 0.3)
  Top 0.152: v46.33,21.64 46.33,23.88 48.87,26.42 49.48,26.42 50.29,27.23 B7.B(-)
  Bottom 0.152: v46.33,21.64 45.31,21.64 R28.1
L7
  Bottom 0.152: 61.57,13.01 57.3,13.01 56.39,12.09 B4ALT.R(-) | 61.57,13.01 64.41,13.01 65.33,13.92 65.53,13.92 R13.1 | 61.57,13.01 61.57,11.07 63.3,9.35 64.21,9.35 65.23,8.33 65.53,8.33 B4.R(-)
L7B
  Bottom 0.152: B8.B(-) 65.53,26.21 | 65.53,26.21 65.53,25.4 R27.1 | 65.53,26.21 63.3,26.21 62.79,25.7 58.83,25.7 56.69,23.57 56.39,23.57 B8ALT.B(-)
L8
  Bottom 0.152: R12.1 26.62,26.42 26.62,26.21 25.6,25.2 24.89,25.2 23.27,23.57 21.34,23.57 B5.G(-)
L9  (via drill 0.3)
  Top 0.152: v22.25,25.09 21.64,25.09 20.12,23.57 19.81,23.57 B5.R(-)
  Bottom 0.152: v22.25,25.09 23.57,26.42 25.4,26.42 R11.1
L10  (via drill 0.3)
  Top 0.152: v41.96,25.3 41.45,25.3 41.25,25.5 38.51,25.5 36.58,23.57 B6.G(-)
  Bottom 0.152: v41.96,25.3 41.96,26.42 R10.1
L11  (via drill 0.3)
  Top 0.152: v43.18,25.4 42.67,25.4 42.16,25.91 38,25.91 36.47,24.38 35.87,24.38 35.05,23.57 B6.R(-)
  Bottom 0.152: v43.18,25.4 R9.1
L12
  Bottom 0.152: R8.1 46.53,22.86 46.84,22.55 50.9,22.55 51.82,23.47 B7.G(-)
L13
  Bottom 0.152: R7.1 45.31,24.18 46.63,24.18 46.84,24.38 49.48,24.38 50.29,23.57 B7.R(-)
L14
  Bottom 0.152: B8.G(-) 67.06,23.57 68.07,24.59 68.07,28.14 66.95,29.26 65.63,29.26 R6.1 65.53,29.26 64.82,29.97 62.89,29.97 61.57,28.65 56.39,28.65 55.07,27.33 54.86,27.33 B8ALT.G(-)
L15  (via drill 0.3)
  Top 0.152: v58.93,24.69 56.39,27.23 B8ALT.R(-)
  Bottom 0.152: 65.53,23.37 B8.R(-) 65.53,23.47 | 65.53,23.37 65.53,21.64 R5.1 | v58.93,24.69 63.2,24.69 63.5,24.38 64.52,24.38 65.53,23.37
N$2  (via drill 0.3)
  Top 0.152: v69.8,22.96 69.39,22.96 67.36,24.99 v66.65,24.99
  Bottom 0.152: v69.8,22.96 70.71,22.05 70.71,21.64 IC3.13 | v66.65,24.99 66.24,24.59 64.82,24.59 64.01,25.4 R27.2
N$3  (via drill 0.3)
  Top 0.152: v50.8,20.52 v53.44,17.88
  Bottom 0.152: v53.44,17.88 68.07,17.88 71.32,21.13 71.32,21.54 IC3.12 | v50.8,20.52 44.7,20.52 43.69,21.54 R28.2
N$4  (via drill 0.3)
  Top 0.152: v1.83,25.91 1.83,25.6 0.81,24.59 0.81,18.19 1.93,17.07 3.35,17.07 7.21,20.93 7.21,21.95 5.49,23.67 5.49,24.69 7.72,26.92 9.75,26.92 12.29,29.46 v13.11,29.46 | v20.83,30.79 21.13,30.79 23.77,33.43 31.29,33.43 v32,32.72 | v34.54,32.72 40.34,32.72 40.44,32.82 53.34,32.82 55.68,30.48 57.61,30.48 60.35,27.74 60.35,23.06 59.44,22.15 59.23,22.15 v58.62,21.54 | v61.67,16.26 v61.67,18.49
  Bottom 0.152: v1.83,25.91 3.45,27.53 4.17,27.53 IC2.13 | v13.11,29.46 14.73,31.09 20.52,31.09 v20.83,30.79 | v34.54,32.72 v32,32.72 | v61.67,18.49 v58.62,21.54 | v61.67,16.26 63.91,14.02 R13.2
N$5  (via drill 0.3)
  Top 0.152: v7.82,29.97 8.94,29.97 12.29,33.33 19.61,33.33 21.23,34.95 57.61,34.95 62.18,30.38 62.18,29.26 61.57,28.65 61.57,26.92 64.11,24.38 67.46,24.38 69.8,22.05 v69.8,13.21 | v66.65,7.01 65.13,7.01 v64.82,7.32
  Bottom 0.152: v7.82,29.97 4.88,27.03 4.27,27.03 IC2.12 | v69.8,13.21 69.8,9.65 67.16,7.01 v66.65,7.01 | v64.82,7.32 63.91,6.4 R14.2
N$6  (via drill 0.3)
  Top 0.152: v52.63,17.27 51.51,17.27 50.8,17.98 47.24,17.98 v46.13,19.1 | v44.6,19.61 44.6,24.69 v43.99,25.3
  Bottom 0.152: v52.63,17.27 53.65,17.27 53.95,17.58 71.12,17.58 72.14,18.59 72.14,19.3 72.03,19.41 72.03,21.54 IC3.11 | v46.13,19.1 45.11,19.1 v44.6,19.61 | v43.99,25.3 43.99,27.03 43.69,27.33 41.35,27.33 40.64,28.04 R29.2
N$7  (via drill 0.3)
  Top 0.152: v8.74,25.09 10.06,25.09 13.21,28.25 15.85,28.25 16.15,28.55 26.62,28.55 28.45,26.72 v28.96,26.72 | v31.8,25.4 36.98,25.4 37.8,26.21 44.7,26.21 45.62,25.3 45.62,19.41 45.52,19.3 45.52,16.66 46.94,15.24 v46.94,13.61
  Bottom 0.152: v8.74,25.09 7.52,26.31 4.27,26.31 IC2.11 | v28.96,26.72 28.96,26.31 29.87,25.4 v31.8,25.4 | v46.94,13.61 46.94,13.11 46.33,12.5 46.33,6.5 46.23,6.4 R15.2
N$9  (via drill 0.3)
  Top 0.152: v7.32,25.7 8.03,25.7 8.94,26.62 9.96,26.62 12.19,28.85 13.31,28.85 14.02,29.57 14.02,30.38 16.36,32.72 22.55,32.72 23.57,33.73 31.8,33.73 v34.44,31.09 | v36.17,31.09 39.83,31.09 40.74,30.18 v43.08,30.18 | v51.31,25.3 52.73,23.88 52.73,23.06 51.1,21.44 49.28,21.44 v46.94,19.1 | v44.6,18.39 44.6,15.24 v43.38,14.02
  Bottom 0.152: v7.32,25.7 4.27,25.7 IC2.10 | v36.17,31.09 v34.44,31.09 | v43.08,30.18 47.95,25.3 v51.31,25.3 | v46.94,19.1 46.23,18.39 v44.6,18.39 | v43.38,14.02 43.38,10.36 44.7,9.04 44.7,6.4 46.02,5.08 R16.2
N$10  (via drill 0.3)
  Top 0.152: v6.1,24.28 6.1,23.88 v6.81,23.16 | v8.03,22.96 8.03,22.05 9.04,21.03 11.28,21.03 11.68,20.62 11.68,20.22 10.26,18.8 8.94,18.8 5.49,15.34 5.49,14.83 5.89,14.43 9.86,14.43 10.87,15.44 14.33,15.44 15.65,16.76 22.35,16.76 26.92,12.19 26.92,10.97 30.58,7.32 38.81,7.32 v39.73,8.23
  Bottom 0.152: v6.1,24.28 5.49,24.89 4.27,24.89 IC2.9 | v6.81,23.16 7.82,23.16 v8.03,22.96 | v39.73,8.23 42.47,8.23 43.18,8.94 R17.2
N$11  (via drill 0.3)
  Top 0.152: v3.15,24.38 6.2,27.43 v6.2,27.53 | v7.82,27.53 9.86,27.53 v12.39,30.07 | v23.77,31.39 24.28,31.39 28.04,27.64 v29.77,27.64 | v38.61,23.67 39.42,23.67 42.67,20.42 42.67,20.02 42.06,19.41 v42.06,11.58
  Bottom 0.152: v3.15,24.38 4.17,24.38 IC2.8 | v7.82,27.53 v6.2,27.53 | v12.39,30.07 13.21,30.07 14.53,31.39 v23.77,31.39 | v29.77,27.64 30.38,27.64 33.33,24.69 37.9,24.69 38.61,23.98 v38.61,23.67 | v42.06,11.58 42.06,9.25 41.96,9.14 R18.2
N$12  (via drill 0.3)
  Top 0.152: v8.23,23.77 9.25,24.79 10.26,24.79 12.7,27.23 15.34,27.23 16.36,28.25 22.25,28.25 24.49,26.01 27.53,26.01 28.96,24.59 v28.96,19.81
  Bottom 0.152: v8.23,23.77 6.6,23.77 6.5,23.67 4.27,23.67 IC2.7 | v28.96,19.81 28.96,13.92 26.72,11.68 26.72,9.14 R19.2
N$13  (via drill 0.3)
  Top 0.152: v71.93,23.77 71.93,24.79 v62.69,34.04 | v40.64,34.04 33.33,34.04 v33.22,33.93
  Bottom 0.152: v71.93,23.77 72.64,23.06 72.64,21.64 IC3.10 | v40.64,34.04 v62.69,34.04 | v33.22,33.93 32.41,33.93 27.94,29.46 R30.2
N$14  (via drill 0.3)
  Top 0.152: v73.25,18.8 73.25,14.94 v67.87,9.55
  Bottom 0.152: v73.25,18.8 73.25,21.54 IC3.9 | v67.87,9.55 66.45,9.55 66.24,9.35 64.82,9.35 64.01,10.16 R31.2
N$15  (via drill 0.3)
  Top 0.152: v72.14,10.67 68.68,7.21 68.68,5.18 65.73,2.23 50.09,2.23 49.99,2.13 49.58,2.13 v48.87,2.85
  Bottom 0.152: v72.14,10.67 72.14,16.87 73.97,18.69 73.97,21.54 IC3.8 | v48.87,2.85 47.14,2.85 46.23,3.76 R32.2
N$16  (via drill 0.3)
  Top 0.152: v59.44,21.54 56.9,19 56.9,18.59 55.88,17.58 53.95,17.58 49.38,13.01 44.3,13.01 v41.45,10.16
  Bottom 0.152: v59.44,21.54 60.05,22.15 61.47,22.15 62.79,20.83 66.75,20.83 70.31,24.38 72.24,24.38 74.57,22.05 74.57,21.64 IC3.7 | v41.45,10.16 40.64,9.35 R33.2
N$17  (via drill 0.3)
  Top 0.152: v75.79,20.52 76.1,20.52 79.35,17.27 v79.35,9.86 | v66.95,4.78 63.8,4.78 61.57,7.01 v53.95,7.01 | v52.73,7.01 52.73,8.64 52.22,9.14 45.31,9.14 v41.25,5.08
  Bottom 0.152: v75.79,20.52 75.29,21.03 75.29,21.54 IC3.6 | v79.35,9.86 74.37,4.88 68.38,4.88 68.28,4.78 v66.95,4.78 | v52.73,7.01 v53.95,7.01 | v41.25,5.08 31.9,5.08 27.94,9.04 R34.2
N$19  (via drill 0.3)
  Top 0.152: v2.34,24.38 2.34,24.69 7.21,29.57 7.21,30.18 11.58,34.54 13.21,34.54 13.41,34.34 17.17,34.34 v17.37,34.54 | v20.42,33.33 21.74,34.65 57.1,34.65 v58.32,33.43 | v73.86,30.48 73.86,18.09 73.56,17.78 73.56,12.9 67.56,6.91 67.56,4.57 65.73,2.74 v49.78,2.74 | v26.01,10.16 v28.96,7.21
  Bottom 0.152: v2.34,24.38 3.66,23.06 4.17,23.06 IC2.6 | v17.37,34.54 18.59,33.33 v20.42,33.33 | v58.32,33.43 70.92,33.43 v73.86,30.48 | v49.78,2.74 49.58,2.74 48.46,1.63 34.54,1.63 v28.96,7.21 | v26.01,10.16 26.01,9.86 25.4,9.25 R20.2
N$20
  Bottom 0.152: IC2.15 10.06,28.25 10.06,28.55 12.19,30.68 13.31,30.68 14.63,32 23.98,32 24.38,31.6 24.38,30.58 26.72,28.25 R12.2
N$21
  Bottom 0.152: IC2.16 10.06,27.64 14.12,27.64 15.04,28.55 25.09,28.55 25.4,28.25 R11.2
N$22
  Bottom 0.152: IC2.17 9.96,27.03 9.55,27.03 9.25,27.33 9.25,29.77 14.63,35.15 38.71,35.15 41.96,31.9 41.96,28.25 R10.2
N$23  (via drill 0.3)
  Top 0.152: v13.61,34.95 16.87,34.95 17.07,35.15 18.9,35.15 v19.51,34.54 | v41.35,29.57 42.37,29.57 v42.67,29.26
  Bottom 0.152: v13.61,34.95 13.61,34.65 8.94,29.97 8.94,27.03 9.65,26.31 9.96,26.31 IC2.18 | v19.51,34.54 26.42,34.54 26.72,34.85 36.07,34.85 v41.35,29.57 | v42.67,29.26 42.67,28.75 43.18,28.25 R9.2
N$24  (via drill 0.3)
  Top 0.152: v24.79,23.06 v23.37,24.49 | v37.8,23.98 38.1,23.98 39.32,25.2 41.05,25.2 42.57,23.67 v42.57,23.57
  Bottom 0.152: v23.37,24.49 19.91,24.49 18.8,25.6 10.06,25.6 IC2.19 | v24.79,23.06 29.57,23.06 30.89,24.38 37.39,24.38 v37.8,23.98 | v42.57,23.57 42.77,23.57 43.48,22.86 R8.2
N$25  (via drill 0.3)
  Top 0.152: v18.8,33.93 v12.09,33.93 | v21.84,33.93 22.15,33.93 22.25,34.04 32.31,34.04 37.8,28.55 v37.8,27.53
  Bottom 0.152: v12.09,33.93 8.43,30.28 8.43,26.21 9.65,24.99 9.96,24.99 IC2.20 | v21.84,33.93 v18.8,33.93 | v37.8,27.53 38.1,27.53 40.44,25.2 41.25,25.2 42.27,24.18 43.59,24.18 R7.2
N$26  (via drill 0.3)
  Top 0.152: v18.69,24.89 20.93,24.89 v21.74,25.7 | v23.67,27.64 27.03,27.64 28.55,26.11 29.57,26.11 v29.77,26.31 | v31.19,26.01 37.08,26.01 39.73,28.65 46.74,28.65 v48.77,30.68 | v60.96,32.82 64.62,29.16 66.24,29.16 v66.75,28.65
  Bottom 0.152: v18.69,24.89 18.39,25.2 12.29,25.2 11.48,24.38 10.06,24.38 IC2.21 | v23.67,27.64 v21.74,25.7 | v29.77,26.31 30.89,26.31 v31.19,26.01 | v48.77,30.68 52.53,30.68 54.66,32.82 v60.96,32.82 | v66.75,28.65 66.45,28.65 66.24,28.45 64.72,28.45 64.01,29.16 R6.2
N$27  (via drill 0.3)
  Top 0.152: v9.04,23.77 9.75,23.77 12.5,26.52 v14.63,26.52 | v39.62,27.74 43.79,27.74 v46.53,24.99 | v52.73,24.69 52.73,24.38 53.85,23.27 53.85,23.16 54.46,22.55 v58.73,22.55
  Bottom 0.152: v9.04,23.77 9.96,23.77 IC2.22 | v14.63,26.52 16.36,28.25 23.88,28.25 24.79,27.33 28.65,27.33 29.87,28.55 38.81,28.55 v39.62,27.74 | v46.53,24.99 50.8,24.99 51.1,24.69 v52.73,24.69 | v58.73,22.55 62.99,22.55 63.91,21.64 R5.2

### Text on the board
_bsilk: v07-13 | BI8-2x4RGB | SKAARHOJ 2013 | GITHUB: SKAARHOJ-Open-Engineering